# Altium schematic sheet DPPXHK_MCU.SchDoc
size A3
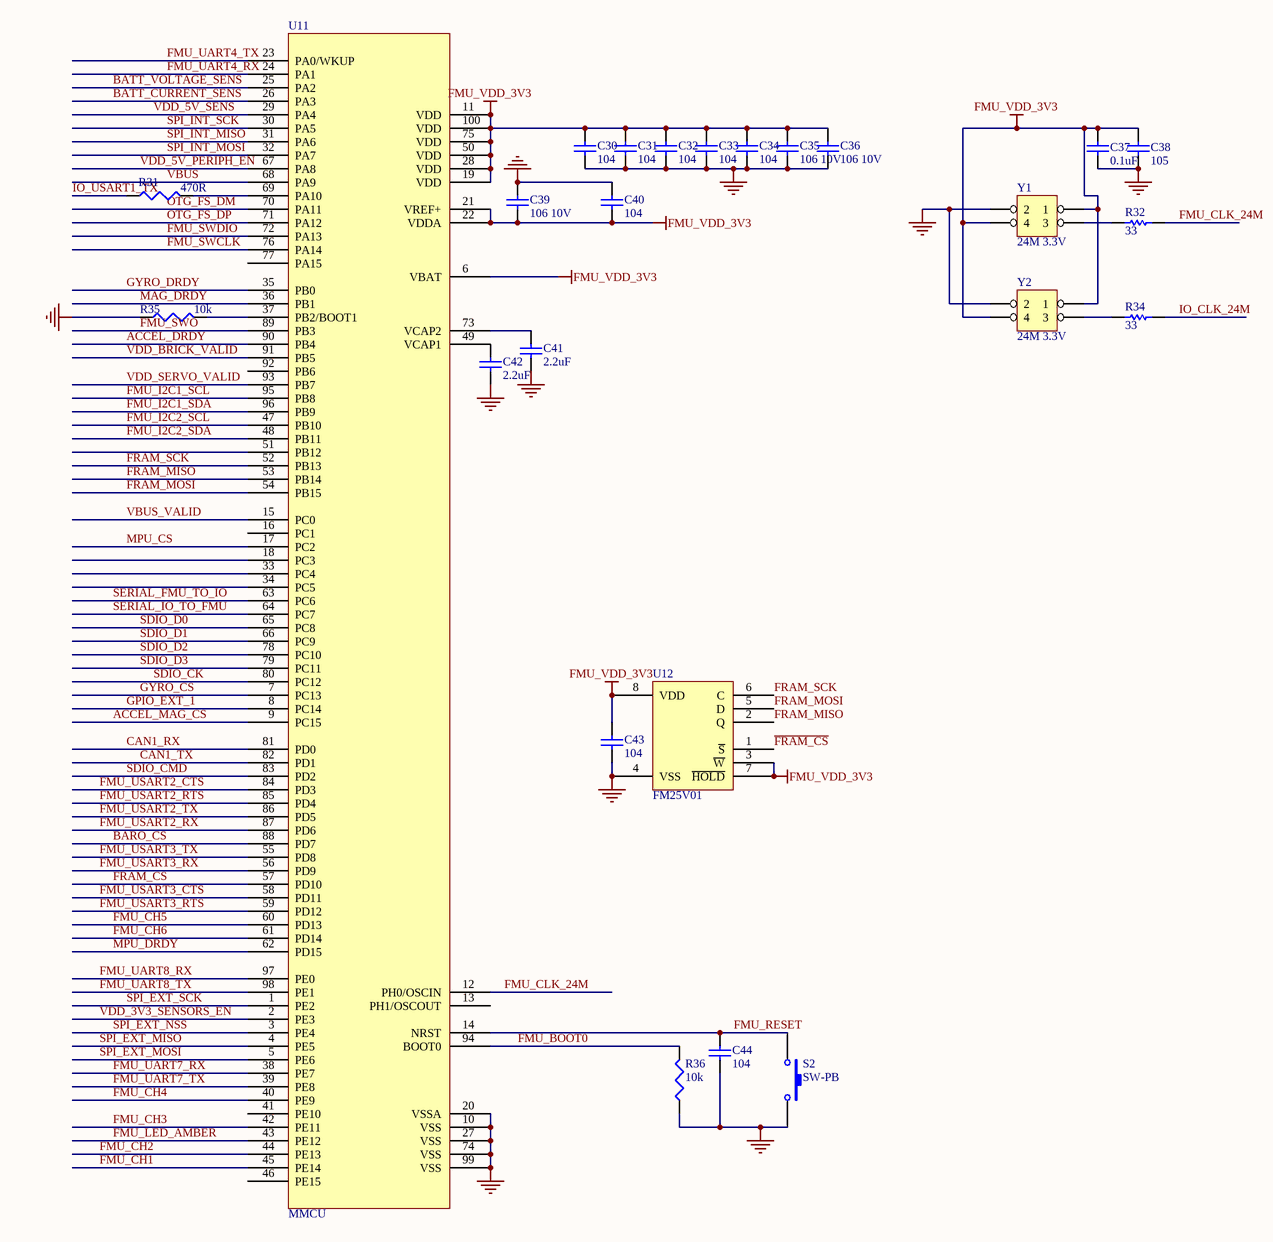
[diagram p0: DPPXHK_MCU.SchDoc]

## Parts
C30  104  [LC0402]
C31  104  [LC0402]
C32  104  [LC0402]
C33  104  [LC0402]
C34  104  [LC0402]
C35  106 10V  [LC0402]
C36  106 10V  [LC0402]
C37  value 0.1uF  [LC0402]  (hidden comment: 104)
C38  105  [LC0402]
C39  106 10V  [LC0402]
C40  104  [LC0402]
C41  2.2uF  [LC0402]
C42  2.2uF  [LC0402]
C43  104  [LC0402]
C44  104  [LC0402]
R31  470R  [0402R]
R32  value 33  [0402R]  (hidden comment: 33R)
R34  value 33  [0402R]  (hidden comment: 33R)
R35  10k  [0402R]
R36  10k  [0402R]
S2  SW-PB  [BUTTON-3*6]
U11  MMCU  [LQFP100st]
U12  FM25V01  [SO-g8]
Y1  24M 3.3V  [OSCILLATOR-3.2X2.5]
Y2  24M 3.3V  [OSCILLATOR-3.2X2.5]

## Nets
FMU_VDD_3V3: C30.1 C31.1 C32.1 C33.1 C34.1 C35.1 C36.1 C37.2 C38.2 C39.2 C40.2 C43.2 U11.6(VBAT) U11.11(VDD) U11.19(VDD) U11.21(VREF+) U11.22(VDDA) U11.28(VDD) U11.50(VDD) U11.75(VDD) U11.100(VDD) U12.3(~{W}) U12.7(~{HOLD}) U12.8(VDD) Y1.1 Y1.4 Y2.1 Y2.4
GND: C30.2 C31.2 C32.2 C33.2 C34.2 C35.2 C36.2 C37.1 C38.1 C39.1 C40.1 C41.2 C42.2 C43.1 C44.1 R35.1 R36.1 S2.2 U11.10(VSS) U11.20(VSSA) U11.27(VSS) U11.74(VSS) U11.99(VSS) U12.4(VSS) Y1.2 Y2.2
~{FRAM_CS}: U11.57(PD10) U12.1(~{S})
ACCEL_DRDY: U11.90(PB4)
ACCEL_MAG_CS: U11.9(PC15)
BARO_CS: U11.88(PD7)
BATT_CURRENT_SENS: U11.26(PA3)
BATT_VOLTAGE_SENS: U11.25(PA2)
CAN1_RX: U11.81(PD0)
CAN1_TX: U11.82(PD1)
FMU_BOOT0: R36.2 U11.94(BOOT0)
FMU_CH1: U11.45(PE14)
FMU_CH2: U11.44(PE13)
FMU_CH3: U11.42(PE11)
FMU_CH4: U11.40(PE9)
FMU_CH5: U11.60(PD13)
FMU_CH6: U11.61(PD14)
FMU_CLK_24M: R32.2 U11.12(PH0/OSCIN)
FMU_I2C1_SCL: U11.95(PB8)
FMU_I2C1_SDA: U11.96(PB9)
FMU_I2C2_SCL: U11.47(PB10)
FMU_I2C2_SDA: U11.48(PB11)
FMU_LED_AMBER: U11.43(PE12)
FMU_RESET: C44.2 S2.1 U11.14(NRST)
FMU_SWCLK: U11.76(PA14)
FMU_SWDIO: U11.72(PA13)
FMU_SWO: U11.89(PB3)
FMU_UART4_RX: U11.24(PA1)
FMU_UART4_TX: U11.23(PA0/WKUP)
FMU_UART7_RX: U11.38(PE7)
FMU_UART7_TX: U11.39(PE8)
FMU_UART8_RX: U11.97(PE0)
FMU_UART8_TX: U11.98(PE1)
FMU_USART2_CTS: U11.84(PD3)
FMU_USART2_RTS: U11.85(PD4)
FMU_USART2_RX: U11.87(PD6)
FMU_USART2_TX: U11.86(PD5)
FMU_USART3_CTS: U11.58(PD11)
FMU_USART3_RTS: U11.59(PD12)
FMU_USART3_RX: U11.56(PD9)
FMU_USART3_TX: U11.55(PD8)
FRAM_MISO: U11.53(PB14) U12.2(Q)
FRAM_MOSI: U11.54(PB15) U12.5(D)
FRAM_SCK: U11.52(PB13) U12.6(C)
GPIO_EXT_1: U11.8(PC14)
GYRO_CS: U11.7(PC13)
GYRO_DRDY: U11.35(PB0)
IO_CLK_24M: R34.2
IO_USART1_TX: R31.1
MAG_DRDY: U11.36(PB1)
MPU_CS: U11.17(PC2)
MPU_DRDY: U11.62(PD15)
OTG_FS_DM: U11.70(PA11)
OTG_FS_DP: U11.71(PA12)
SDIO_CK: U11.80(PC12)
SDIO_CMD: U11.83(PD2)
SDIO_D0: U11.65(PC8)
SDIO_D1: U11.66(PC9)
SDIO_D2: U11.78(PC10)
SDIO_D3: U11.79(PC11)
SERIAL_FMU_TO_IO: U11.63(PC6)
SERIAL_IO_TO_FMU: U11.64(PC7)
SPI_EXT_MISO: U11.4(PE5)
SPI_EXT_MOSI: U11.5(PE6)
SPI_EXT_NSS: U11.3(PE4)
SPI_EXT_SCK: U11.1(PE2)
SPI_INT_MISO: U11.31(PA6)
SPI_INT_MOSI: U11.32(PA7)
SPI_INT_SCK: U11.30(PA5)
VBUS: U11.68(PA9)
VBUS_VALID: U11.15(PC0)
VDD_3V3_SENSORS_EN: U11.2(PE3)
VDD_5V_PERIPH_EN: U11.67(PA8)
VDD_5V_SENS: U11.29(PA4)
VDD_BRICK_VALID: U11.91(PB5)
VDD_SERVO_VALID: U11.93(PB7)
NetC41_1: C41.1 U11.73(VCAP2)
NetC42_1: C42.1 U11.49(VCAP1)
NetR31_2: R31.2 U11.69(PA10)
NetR32_1: R32.1 Y1.3
NetR34_1: R34.1 Y2.3
NetR35_2: R35.2 U11.37(PB2/BOOT1)

Not connected (* = marked no-connect by the designer): U11 13(PH1/OSCOUT) 16(PC1) 18(PC3) 33(PC4) 34(PC5) 41(PE10) 46(PE15) 51(PB12) 77(PA15) 92(PB6)

## Library data of the parts
C30-C44 = Cap Semi: Capacitor (Semiconductor SIM Model); Published: 8-Jun-2000; Publisher: Altium Limited
  C30-C36 C39-C44: LatestRevisionDate: 17-Jul-2002; LatestRevisionNote: Re-released for DXP Platform.; PackageReference: C1206
  C37: Revision: July-2002: Re-released for DXP Platform.
  C38: Revision: July-2002: Re-released for DXP Platform.; Value: 105
R31 R35 R36 = Res3: Resistor; Published: 8-Jun-2000; LatestRevisionDate: 4-Mar-2005; LatestRevisionNote: PCB Footprint replaced.; Publisher: Altium Limited
R32 R34 = Res1: Resistor; Manufacturer: Generic Components; Class: Passive; Published: 08/06/2000; Publisher: Altium Hobart Technology Centre; SubClass: Resistor
S2 = SW-PB: Switch; Published: 24-Mar-1999; LatestRevisionDate: 17-Jul-2002; LatestRevisionNote: Re-released for DXP Platform.; Publisher: Altium Limited
U11 = F4x7
Y1 Y2 = HEADER 2X2